# Altium schematic sheet 04 POWER.SchDoc
size 420 x 297 mm
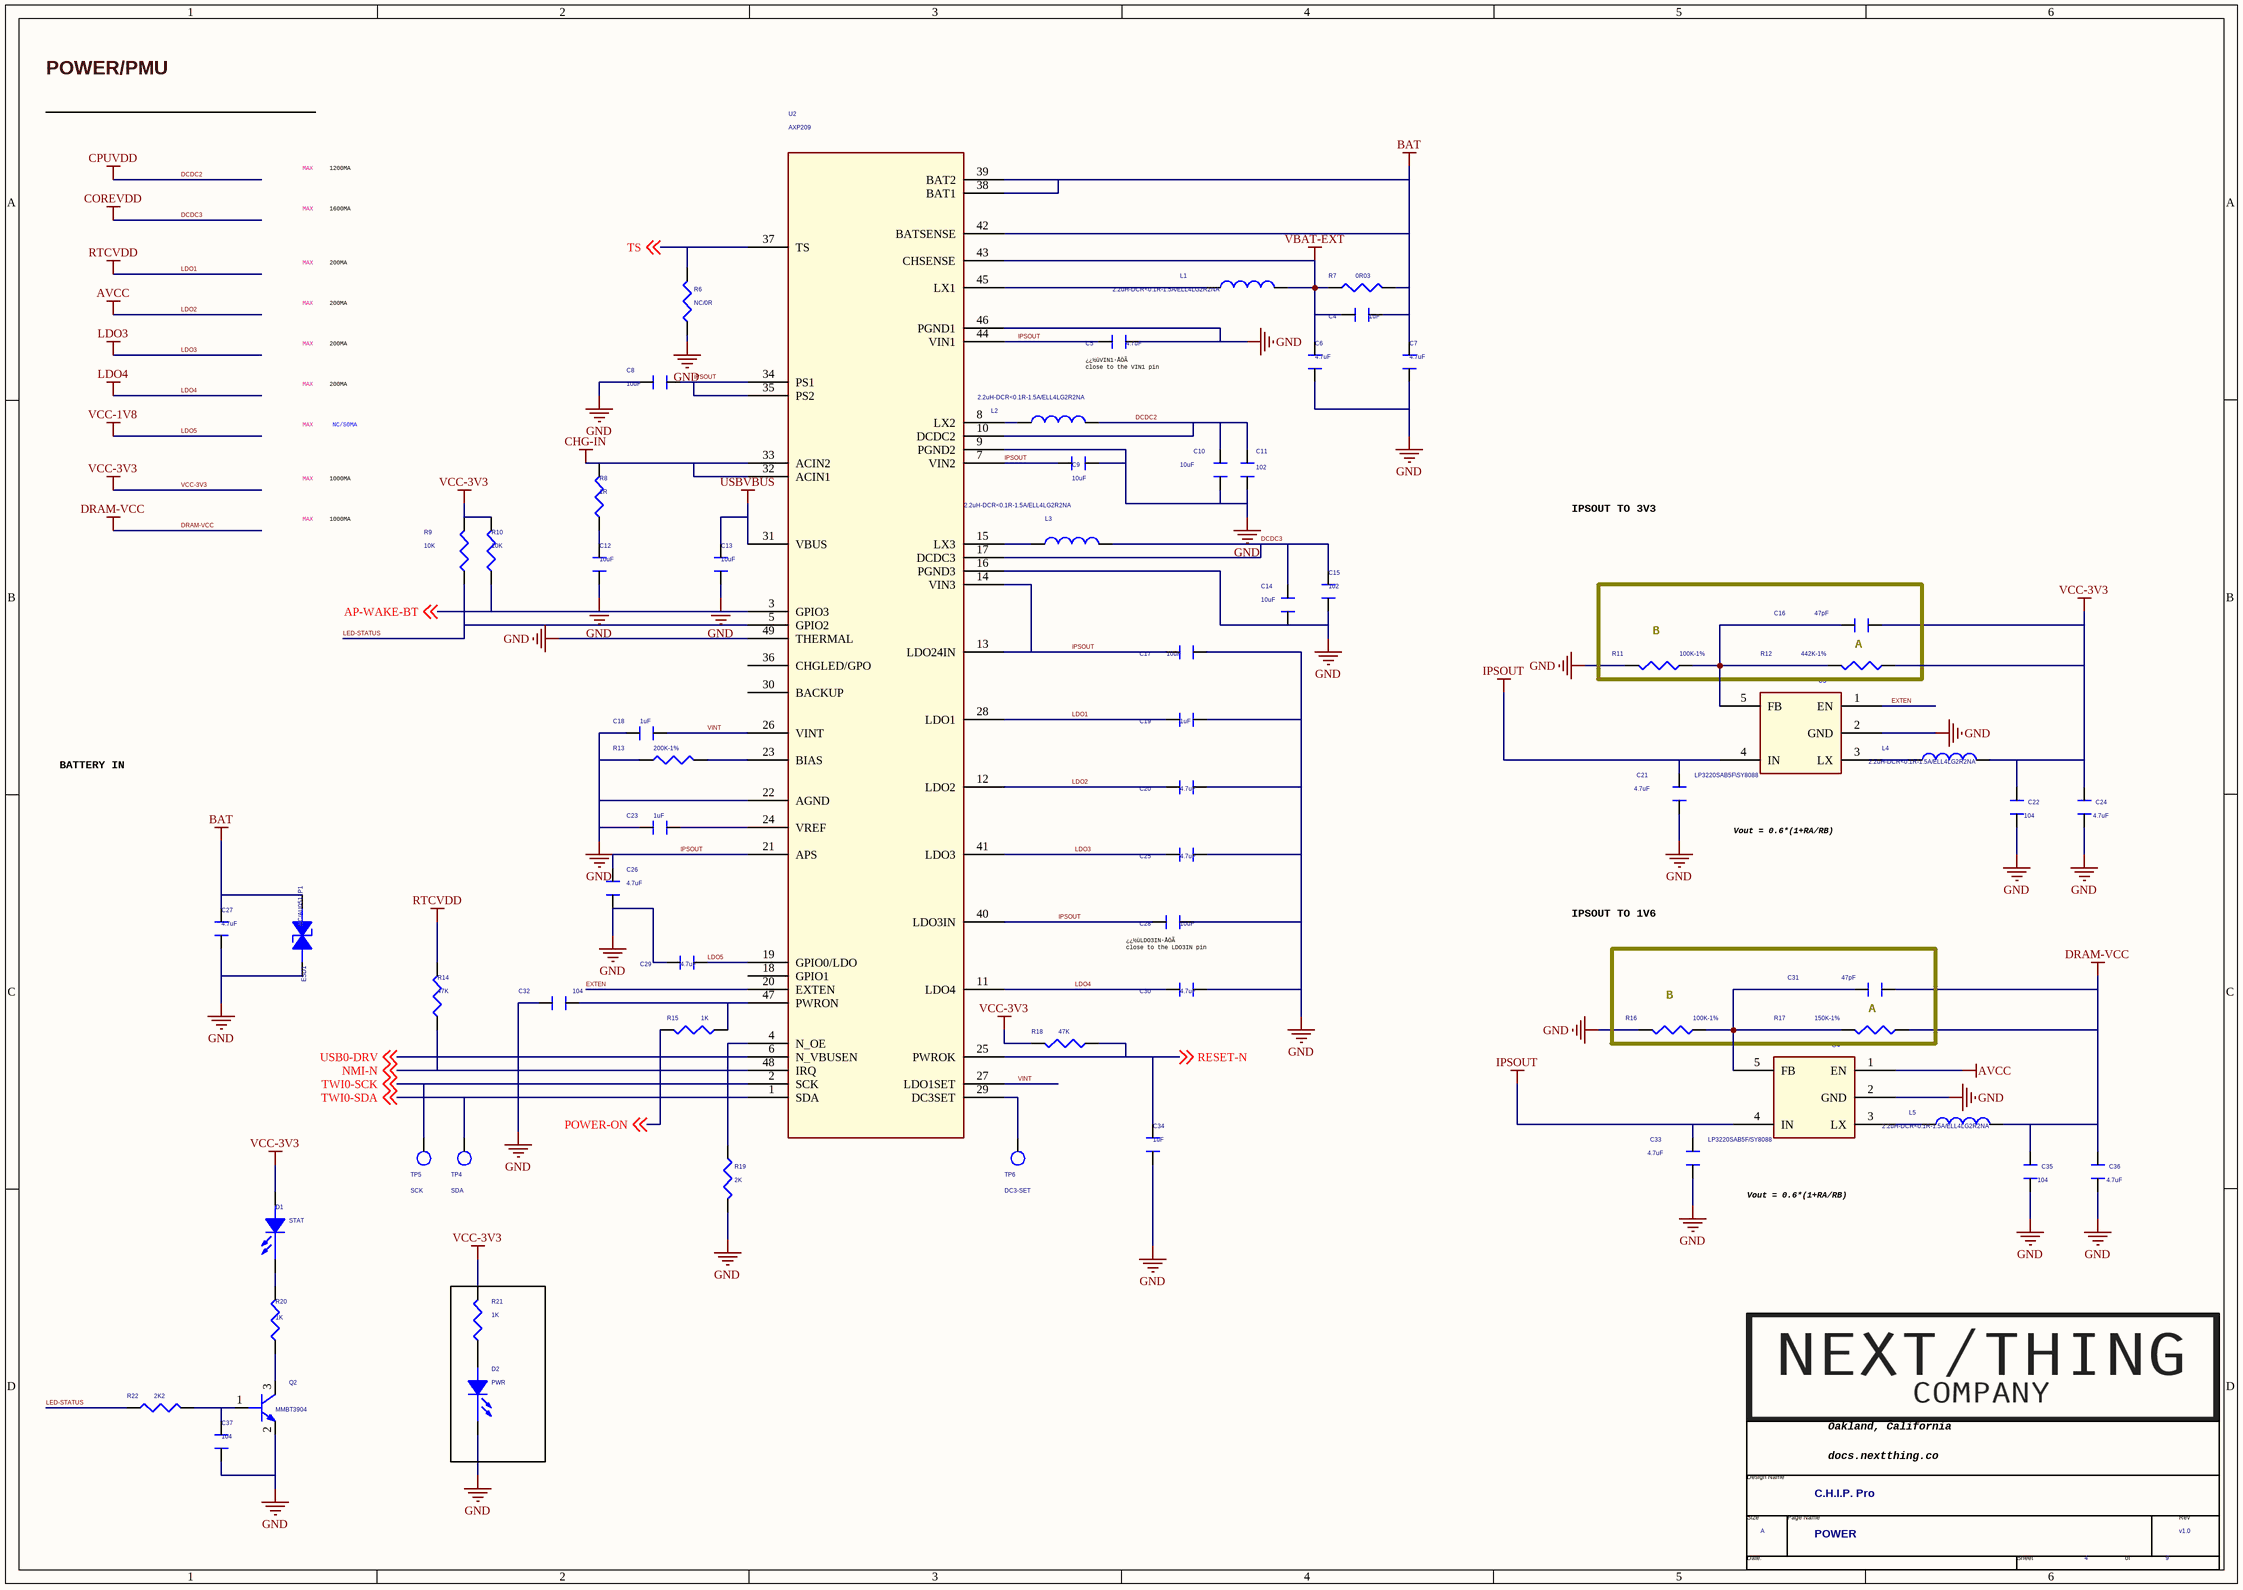
[diagram p0: 04 POWER.SchDoc]

## Parts
*  Page Count: 9  Page Number: 4  Page Size: A  Title: C.H.I.P. Pro  RevCode: v1.0  Doc: POWER  (hidden comment: TitleBlock1-nextthing)  (graphical)
C4  1uF  [C0402]
C5  4.7uF  [C0603]
C6  4.7uF  [C0603]
C7  4.7uF  [C0603]
C8  10uF  [C0603]
C9  10uF  [C0603]
C10  10uF  [C0603]
C11  102  [C0201]
C12  10uF  [C0603]
C13  10uF  [C0603]
C14  10uF  [C0603]
C15  102  [C0201]
C16  47pF  [C0201]
C17  10uF  [C0603]
C18  1uF  [C0402]
C19  1uF  [C0402]
C20  4.7uF  [C0603]
C21  4.7uF  [C0603]
C22  104  [C0201]
C23  1uF  [C0402]
C24  4.7uF  [C0603]
C25  4.7uF  [C0603]
C26  4.7uF  [C0603]
C27  4.7uF  [C0603]
C28  10uF  [C0603]
C29  4.7uF  [C0603]
C30  4.7uF  [C0603]
C31  47pF  [C0201]
C32  104  [C0201]
C33  4.7uF  [C0603]
C34  1uF  [C0402]
C35  104  [C0201]
C36  4.7uF  [C0603]
C37  104  [C0201]
D1  STAT  [D0603]
D2  PWR  [D0603]
ESD1  NC/AU0511P1  [ESD0402]
L1  2.2uH-DCR<0.1R-1.5A/ELL4LG2R2NA  [L3518]
L2  2.2uH-DCR<0.1R-1.5A/ELL4LG2R2NA  [L3518]
L3  2.2uH-DCR<0.1R-1.5A/ELL4LG2R2NA  [L3518]
L4  2.2uH-DCR<0.1R-1.5A/ELL4LG2R2NA  [L3518]
L5  2.2uH-DCR<0.1R-1.5A/ELL4LG2R2NA  [L3518]
Q2  MMBT3904  [SOT-23]
R6  NC/0R  [R0201]
R7  0R03  [R0805]
R8  1R  [R0402]
R9  10K  [R0201]
R10  10K  [R0201]
R11  100K-1%  [R0402]
R12  442K-1%  [R0402]
R13  200K-1%  [R0201]
R14  47K  [R0201]
R15  1K  [R0201]
R16  100K-1%  [R0402]
R17  150K-1%  [R0402]
R18  47K  [R0201]
R19  2K  [R0201]
R20  1K  [R0201]
R21  1K  [R0201]
R22  2K2  [R0201]
TP4  SDA  [tp40_smd]
TP5  SCK  [tp40_smd]
TP6  DC3-SET  [tp40_smd]
U2  AXP209  [QFN49_0_4H0_8A]
U3  LP3220SAB5F\SY8088  [TSOT-23-6]
U4  LP3220SAB5F/SY8088  [TSOT-23-6]

## Nets
BAT: C4.2 C7.1 C27.2 ESD1.1(ANODE) R7.1 U2.38(BAT1) U2.39(BAT2) U2.42(BATSENSE)
CHG-IN: R8.2 U2.32(ACIN1) U2.33(ACIN2)
DCDC2: C10.1 C11.1 L2.1 U2.10(DCDC2)  [also labelled CPUVDD]
DCDC3: C14.1 C15.1 L3.1 U2.17(DCDC3)  [also labelled COREVDD]
DRAM-VCC: C31.1 C35.1 C36.1 L5.1 R17.2
GND: C5.2 C6.2 C7.2 C8.1 C9.2 C10.2 C11.2 C12.2 C13.2 C14.2 C15.2 C17.2 C18.2 C19.1 C20.2 C21.2 C22.2 C23.1 C24.2 C25.1 C26.2 C27.1 C28.2 C29.2 C30.1 C32.1 C33.2 C34.1 C35.2 C36.2 C37.1 D2.2(CATHODE) ESD1.2(CATHODE) Q2.2(E) R6.1 R11.1 R13.1 R16.1 R19.2 U2.9(PGND2) U2.16(PGND3) U2.22(AGND) U2.46(PGND1) U2.49(THERMAL) U3.2(GND) U4.2(GND)
IPSOUT: C5.1 C8.2 C9.1 C17.1 C21.1 C26.1 C28.1 C33.1 U2.7(VIN2) U2.13(LDO24IN) U2.14(VIN3) U2.21(APS) U2.34(PS1) U2.35(PS2) U2.40(LDO3IN) U2.44(VIN1) U3.4(IN) U4.4(IN)
LDO1: C19.2 R14.2 U2.28(LDO1)  [also labelled RTCVDD]
LDO2: C20.1 U2.12(LDO2) U4.1(EN)  [also labelled AVCC]
LDO3: C25.2 U2.41(LDO3)
LDO4: C30.2 U2.11(LDO4)
LDO5: C29.1 U2.19(GPIO0/LDO)  [also labelled VCC-1V8]
USBVBUS: C13.1 U2.31(VBUS)
VBAT-EXT: C4.1 C6.1 L1.1 R7.2 U2.43(CHSENSE)
VCC-3V3: C16.1 C22.1 C24.1 D1.1(ANODE) L4.1 R9.2 R10.2 R12.2 R18.2 R21.2
AP-WAKE-BT: R10.1 U2.3(GPIO3) ; off-sheet AP-WAKE-BT
EXTEN: U2.20(EXTEN) U3.1(EN)
LED-STATUS: R9.1 R22.2 U2.5(GPIO2)
NMI-N: R14.1 U2.48(IRQ) ; off-sheet NMI-N
POWER-ON: R15.2 ; off-sheet POWER-ON
RESET-N: C34.2 R18.1 U2.25(PWROK) ; off-sheet RESET-N
TS: R6.2 U2.37(TS) ; off-sheet TS
TWI0-SCK: TP5.1(TP) U2.2(SCK) ; off-sheet TWI0-SCK
TWI0-SDA: TP4.1(TP) U2.1(SDA) ; off-sheet TWI0-SDA
USB0-DRV: U2.6(N_VBUSEN) ; off-sheet USB0-DRV
VINT: C18.1 U2.26(VINT) U2.27(LDO1SET)
NetC12_1: C12.1 R8.1
NetC16_2: C16.2 R11.2 R12.1 U3.5(FB)
NetC23_2: C23.2 U2.24(VREF)
NetC31_2: C31.2 R16.2 R17.1 U4.5(FB)
NetC32_2: C32.2 R15.1 U2.47(PWRON)
NetC37_2: C37.2 Q2.1(B) R22.1
NetD1_2: D1.2(CATHODE) R20.1
NetD2_1: D2.1(ANODE) R21.1
NetL1_2: L1.2 U2.45(LX1)
NetL2_2: L2.2 U2.8(LX2)
NetL3_2: L3.2 U2.15(LX3)
NetL4_2: L4.2 U3.3(LX)
NetL5_2: L5.2 U4.3(LX)
NetQ2_3: Q2.3(C) R20.2
NetR13_2: R13.2 U2.23(BIAS)
NetR19_1: R19.1 U2.4(N_OE)
NetTP6_1: TP6.1(TP) U2.29(DC3SET)

Not connected (* = marked no-connect by the designer): U2 18(GPIO1) 30(BACKUP) 36(CHGLED/GPO)

## Notes on the sheet
- POWER/PMU
- MAX
- 1200MA
- 200MA
- 1600MA
- (near C5) ¿¿½üVIN1·ÅÖÃ
  close to the VIN1 pin
- NC/50MA
- 1000MA
- IPSOUT TO 3V3
- (near R11) B
- A
- BATTERY IN
- Vout = 0.6*(1+RA/RB)
- (near C28) ¿¿½üLDO3IN·ÅÖÃ
  close to the LDO3IN pin
- IPSOUT TO 1V6
- (near R16) B
- (in symbol TitleBlock1-nextthing) Oakland, California; Design Name; docs.nextthing.co /; Size; Page Name; Rev; Date:; Sheet; of

## Library data of the parts
C4-C10 C12-C14 C17-C20 C23 C25 C26 C28-C30 C32 C34 = CAPACITOR_0_Dup2: PAGE: 1
C11 C15 = CAPACITOR_1: PAGE: 1
C16 C21 C22 C24 C31 C33 C35 C36 = CAPACITOR_0_Dup1: PAGE: 1
C27 = CAPACITOR_0_Dup4: PAGE: 1
C37 = CAPACITOR_0_Dup4: ROOM: MODEM; PAGE: 3
D1 = LED_0: PAGE: 1; ROOM: MODEM
D2 = LED_0: PAGE: 1
ESD1 = 1_1.5KE100A: 1ST PART DESCRIPTION: WILL ESD9B5V Bidirection ESD Protection
L1-L3 = INDUCTOR_1
L4 L5 = INDUCTOR_0
Q2 = NPN: ROOM: MODEM
R6 R8-R10 R13-R15 R18 R19 R21 = R_Dup1
R7 = R: PAGE: 1
R11 R12 R16 R17 = ?_0
R20 R22 = RESISTOR: ROOM: MODEM
TP4 TP5 = T_POINT_R
TP6 = T_POINT_R_Dup1
U2 = AW1612_0
U3 U4 = RT9293B_0
* = TitleBlock1-nextthing: Page Create Date: March  8, 1995